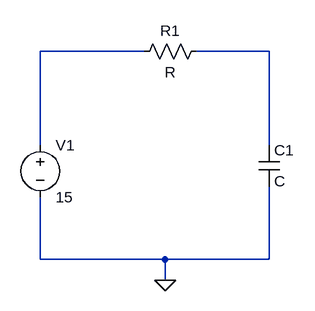
[diagram p0: schematic Draft1.asc]
Draft1.asc, the LTspice schematic file:
Version 4
SHEET 1 880 680
WIRE 192 144 32 144
WIRE 384 144 272 144
WIRE 32 288 32 144
WIRE 384 288 384 144
WIRE 32 464 32 368
WIRE 224 464 32 464
WIRE 384 464 384 352
WIRE 384 464 224 464
WIRE 224 496 224 464
FLAG 224 496 0
SYMBOL res 288 128 R90
WINDOW 0 0 56 VBottom 2
WINDOW 3 32 56 VTop 2
SYMATTR InstName R1
SYMBOL voltage 32 272 R0
WINDOW 123 0 0 Left 0
WINDOW 39 0 0 Left 0
SYMATTR InstName V1
SYMATTR Value 15
SYMBOL cap 368 288 R0
SYMATTR InstName C1

The netlist it stands for:
* Draft1.asc
R1 N002 N001 R
V1 N001 0 15
C1 N002 0 C
.backanno
.end